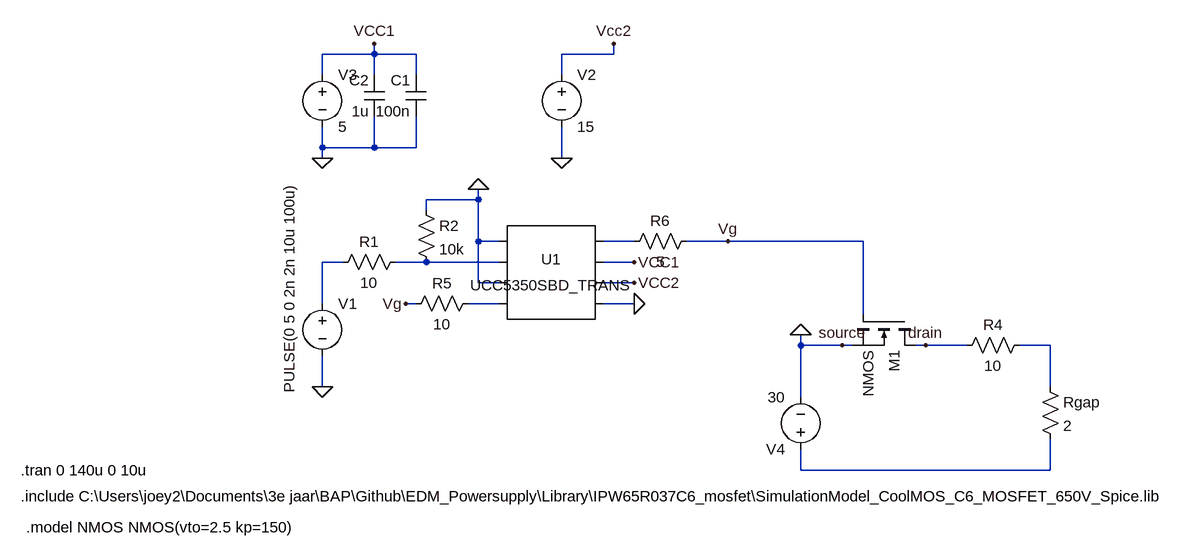
[diagram p0: schematic EDM_Powersupply_V3.asc]
EDM_Powersupply_V3.asc, the LTspice schematic file:
Version 4
SHEET 1 1268 680
WIRE -176 -160 -176 -176
WIRE -176 -160 -256 -160
WIRE -112 -160 -176 -160
WIRE 192 -160 192 -176
WIRE 192 -160 112 -160
WIRE -256 -128 -256 -160
WIRE -176 -128 -176 -160
WIRE -112 -128 -112 -160
WIRE 112 -128 112 -160
WIRE -256 -16 -256 -48
WIRE -176 -16 -176 -64
WIRE -176 -16 -256 -16
WIRE -112 -16 -112 -64
WIRE -112 -16 -176 -16
WIRE -256 0 -256 -16
WIRE 112 0 112 -48
WIRE -16 64 -16 48
WIRE -16 64 -96 64
WIRE -96 80 -96 64
WIRE -16 128 -16 64
WIRE 16 128 -16 128
WIRE 224 128 176 128
WIRE 368 128 304 128
WIRE 576 128 368 128
WIRE -224 160 -256 160
WIRE -96 160 -144 160
WIRE 16 160 -96 160
WIRE 224 160 176 160
WIRE -16 192 -16 128
WIRE 16 192 -16 192
WIRE 224 192 176 192
WIRE -256 224 -256 160
WIRE -112 224 -128 224
WIRE 16 224 -32 224
WIRE 224 224 176 224
WIRE 576 240 576 128
WIRE 480 288 480 272
WIRE 544 288 480 288
WIRE 560 288 544 288
WIRE 672 288 656 288
WIRE 736 288 672 288
WIRE 864 288 816 288
WIRE -256 352 -256 304
WIRE 864 352 864 288
WIRE 480 368 480 288
WIRE 480 480 480 448
WIRE 864 480 864 432
WIRE 864 480 480 480
FLAG -256 352 0
FLAG -256 0 0
FLAG 224 192 VCC2
FLAG 192 -176 Vcc2
FLAG 224 160 VCC1
FLAG -176 -176 VCC1
FLAG 368 128 Vg
FLAG -128 224 Vg
FLAG -16 48 0
FLAG 672 288 drain
FLAG 544 288 source
FLAG 224 224 0
FLAG 112 0 0
FLAG 480 272 0
SYMBOL AutoGenerated\\UCC5350SBD_TRANS 96 176 R0
SYMATTR InstName U1
SYMBOL voltage -256 208 R0
WINDOW 123 0 0 Left 0
WINDOW 39 0 0 Left 0
WINDOW 3 -51 153 VLeft 2
SYMATTR Value PULSE(0 5 0 2n 2n 10u 100u)
SYMATTR InstName V1
SYMBOL voltage 112 -144 R0
WINDOW 123 0 0 Left 0
WINDOW 39 0 0 Left 0
SYMATTR InstName V2
SYMATTR Value 15
SYMBOL cap -96 -64 R180
WINDOW 0 24 56 Left 2
WINDOW 3 24 8 Left 2
SYMATTR InstName C1
SYMATTR Value 100n
SYMBOL cap -160 -64 R180
WINDOW 0 24 56 Left 2
WINDOW 3 24 8 Left 2
SYMATTR InstName C2
SYMATTR Value 1u
SYMBOL voltage -256 -144 R0
WINDOW 123 0 0 Left 0
WINDOW 39 0 0 Left 0
SYMATTR InstName V3
SYMATTR Value 5
SYMBOL res -128 144 R90
WINDOW 0 0 56 VBottom 2
WINDOW 3 32 56 VTop 2
SYMATTR InstName R1
SYMATTR Value 10
SYMBOL res -112 64 R0
SYMATTR InstName R2
SYMATTR Value 10k
SYMBOL res 720 304 R270
WINDOW 0 32 56 VTop 2
WINDOW 3 0 56 VBottom 2
SYMATTR InstName R4
SYMATTR Value 10
SYMBOL voltage 480 464 R180
WINDOW 123 0 0 Left 0
WINDOW 39 0 0 Left 0
SYMATTR InstName V4
SYMATTR Value 30
SYMBOL res -16 208 R90
WINDOW 0 0 56 VBottom 2
WINDOW 3 32 56 VTop 2
SYMATTR InstName R5
SYMATTR Value 10
SYMBOL res 320 112 R90
WINDOW 0 0 56 VBottom 2
WINDOW 3 32 56 VTop 2
SYMATTR InstName R6
SYMATTR Value 5
SYMBOL nmos 656 240 R90
SYMATTR InstName M1
SYMBOL res 848 336 R0
SYMATTR InstName Rgap
SYMATTR Value 2
TEXT -720 520 Left 2 !.include C:\\Users\\joey2\\Documents\\3e jaar\\BAP\\Github\\EDM_Powersupply\\Library\\IPW65R037C6_mosfet\\SimulationModel_CoolMOS_C6_MOSFET_650V_Spice.lib
TEXT -720 480 Left 2 !.tran 0 140u 0 10u
TEXT -712 568 Left 2 !.model NMOS NMOS(vto=2.5 kp=150)

The netlist it stands for:
* EDM_Powersupply_V3.asc
* U1: UCC5350SBD_TRANS (symbol AutoGenerated\UCC5350SBD_TRANS not available, pins judged from their places): pin1=0 pin2=N003 pin3=0 pin4=N004 pin5=N001 pin6=VCC1 pin7=VCC2 pin8=0
V1 N002 0 PULSE(0 5 0 2n 2n 10u 100u)
V2 VCC2 0 15
C1 0 VCC1 100n
C2 0 VCC1 1u
V3 VCC1 0 5
R1 N003 N002 10
R2 0 N003 10k
R4 drain N005 10
V4 N006 0 30
R5 N004 Vg 10
R6 Vg N001 5
M1 drain Vg 0 0 NMOS
Rgap N005 N006 2
.model NMOS NMOS
.model PMOS PMOS
.lib standard.mos
.include C:\Users\joey2\Documents\3e jaar\BAP\Github\EDM_Powersupply\Library\IPW65R037C6_mosfet\SimulationModel_CoolMOS_C6_MOSFET_650V_Spice.lib
.tran 0 140u 0 10u
.model NMOS NMOS(vto=2.5 kp=150)
.backanno
.end